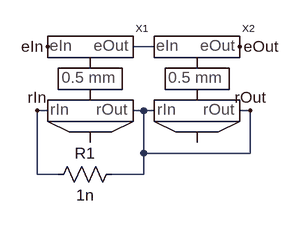
[diagram p0: schematic contactUnit_1p0mm.asc]
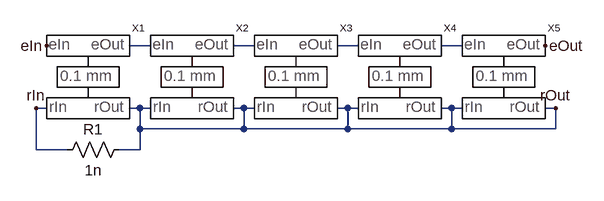
[diagram p1: sub-circuit contactunit_0p5mm.asc]
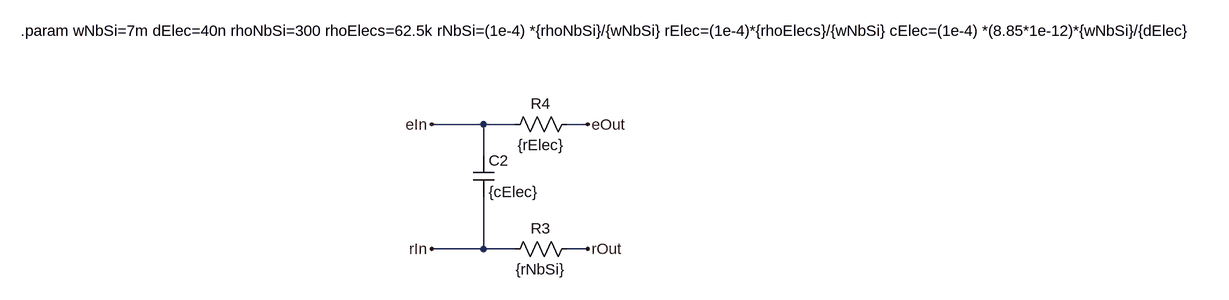
[diagram p2: sub-circuit baseunit_0p1mm.asc]
contactUnit_1p0mm.asc, the LTspice schematic file:
Version 4
SHEET 1 880 680
WIRE 112 80 80 80
WIRE -48 176 -64 176
WIRE 96 176 80 176
WIRE 112 176 96 176
WIRE 256 176 240 176
WIRE 96 240 96 176
WIRE 256 240 256 176
WIRE 256 240 96 240
WIRE -64 272 -64 176
WIRE -32 272 -64 272
WIRE 96 272 96 240
WIRE 96 272 48 272
FLAG -48 80 eIn
FLAG -64 176 rIn
FLAG 240 80 eOut
FLAG 256 176 rOut
SYMBOL contactUnit_0p5mm 16 128 R0
SYMATTR InstName X1
SYMBOL contactUnit_0p5mm 176 128 R0
SYMATTR InstName X2
SYMBOL res 64 256 R90
WINDOW 0 0 56 VBottom 2
WINDOW 3 32 56 VTop 2
SYMATTR InstName R1
SYMATTR Value 1n

contactunit_0p5mm.asc, the sub-circuit schematic file:
Version 4
SHEET 1 880 680
WIRE 112 80 80 80
WIRE 272 80 240 80
WIRE 432 80 400 80
WIRE 592 80 560 80
WIRE -48 176 -64 176
WIRE 96 176 80 176
WIRE 112 176 96 176
WIRE 256 176 240 176
WIRE 272 176 256 176
WIRE 416 176 400 176
WIRE 432 176 416 176
WIRE 576 176 560 176
WIRE 592 176 576 176
WIRE 736 176 720 176
WIRE 96 208 96 176
WIRE 256 208 256 176
WIRE 256 208 96 208
WIRE 416 208 416 176
WIRE 416 208 256 208
WIRE 576 208 576 176
WIRE 576 208 416 208
WIRE 736 208 736 176
WIRE 736 208 576 208
WIRE -64 240 -64 176
WIRE -16 240 -64 240
WIRE 96 240 96 208
WIRE 96 240 64 240
FLAG -48 80 eIn
FLAG -64 176 rIn
FLAG 720 80 eOut
FLAG 736 176 rOut
SYMBOL baseUnit_0p1mm 16 128 R0
SYMATTR InstName X1
SYMBOL baseUnit_0p1mm 176 128 R0
SYMATTR InstName X2
SYMBOL baseUnit_0p1mm 336 128 R0
SYMATTR InstName X3
SYMBOL baseUnit_0p1mm 496 128 R0
SYMATTR InstName X4
SYMBOL baseUnit_0p1mm 656 128 R0
SYMATTR InstName X5
SYMBOL res 80 224 R90
WINDOW 0 0 56 VBottom 2
WINDOW 3 32 56 VTop 2
SYMATTR InstName R1
SYMATTR Value 1n

baseunit_0p1mm.asc, the sub-circuit schematic file:
Version 4
SHEET 1 17700 1016
WIRE 464 -16 384 -16
WIRE 512 -16 464 -16
WIRE 624 -16 592 -16
WIRE 464 32 464 -16
WIRE 464 176 464 96
WIRE 464 176 384 176
WIRE 512 176 464 176
WIRE 624 176 592 176
FLAG 384 -16 eIn
FLAG 624 -16 eOut
FLAG 384 176 rIn
FLAG 624 176 rOut
SYMBOL res 608 160 R90
WINDOW 0 0 56 VBottom 2
WINDOW 3 32 56 VTop 2
SYMATTR InstName R3
SYMATTR Value {rNbSi}
SYMBOL res 608 -32 R90
WINDOW 0 0 56 VBottom 2
WINDOW 3 32 56 VTop 2
SYMATTR InstName R4
SYMATTR Value {rElec}
SYMBOL cap 448 32 R0
SYMATTR InstName C2
SYMATTR Value {cElec}
TEXT -248 -160 Left 2 !.param wNbSi=7m dElec=40n rhoNbSi=300 rhoElecs=62.5k rNbSi=(1e-4) *{rhoNbSi}/{wNbSi} rElec=(1e-4)*{rhoElecs}/{wNbSi} cElec=(1e-4) *(8.85*1e-12)*{wNbSi}/{dElec}

The netlist it stands for:
* contactUnit_1p0mm.asc
XX1 eIn N001 rIn rOut contactunit_0p5mm
XX2 N001 eOut rOut rOut contactunit_0p5mm
R1 rOut rIn 1n

* block symbol definitions
.subckt contactunit_0p5mm eIn eOut rIn rOut
XX1 eIn N001 rIn rOut baseunit_0p1mm
XX2 N001 N002 rOut rOut baseunit_0p1mm
XX3 N002 N003 rOut rOut baseunit_0p1mm
XX4 N003 N004 rOut rOut baseunit_0p1mm
XX5 N004 eOut rOut rOut baseunit_0p1mm
R1 rOut rIn 1n
.ends contactunit_0p5mm

.subckt baseunit_0p1mm eIn eOut rIn rOut
R3 rOut rIn {rNbSi}
R4 eOut eIn {rElec}
C2 eIn rIn {cElec}
.param wNbSi=7m dElec=40n rhoNbSi=300 rhoElecs=62.5k rNbSi=(1e-4) *{rhoNbSi}/{wNbSi} rElec=(1e-4)*{rhoElecs}/{wNbSi} cElec=(1e-4) *(8.85*1e-12)*{wNbSi}/{dElec}
.ends baseunit_0p1mm

.backanno
.end